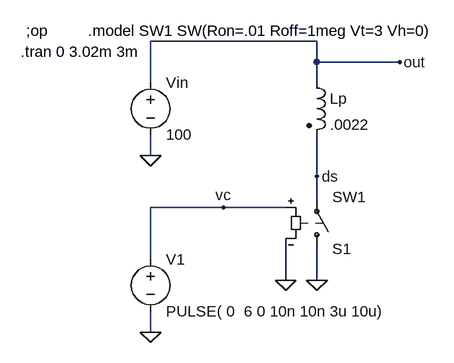
[diagram p0: schematic pulsed_inductor.asc]
pulsed_inductor.asc, the LTspice schematic file:
Version 4
SHEET 1 1728 680
WIRE 0 0 -256 0
WIRE 0 32 0 0
WIRE 128 32 0 32
WIRE -256 64 -256 0
WIRE 0 64 0 32
WIRE -256 176 -256 144
WIRE 0 208 0 144
WIRE 0 240 0 208
WIRE -144 256 -256 256
WIRE -48 256 -144 256
WIRE -256 336 -256 256
WIRE -48 368 -48 304
WIRE 0 368 0 320
WIRE -256 448 -256 416
FLAG 0 368 0
FLAG -48 368 0
FLAG -256 448 0
FLAG -256 176 0
FLAG -144 256 vc
FLAG 0 208 ds
FLAG 128 32 out
SYMBOL sw 0 336 M180
SYMATTR InstName S1
SYMATTR Value SW1
SYMBOL voltage -256 320 R0
WINDOW 123 0 0 Left 0
WINDOW 39 0 0 Left 0
SYMATTR InstName V1
SYMATTR Value PULSE( 0  6 0 10n 10n 3u 10u)
SYMBOL voltage -256 48 R0
WINDOW 123 0 0 Left 0
WINDOW 39 0 0 Left 0
SYMATTR InstName Vin
SYMATTR Value 100
SYMBOL ind2 -16 48 R0
SYMATTR InstName Lp
SYMATTR Value .0022
SYMATTR Type ind
TEXT -352 -16 Left 0 !.model SW1 SW(Ron=.01 Roff=1meg Vt=3 Vh=0)
TEXT -456 16 Left 0 !.tran 0 3.02m 3m
TEXT -448 -16 Left 0 !;op

The netlist it stands for:
* pulsed_inductor.asc
S1 0 ds vc 0 SW1
V1 vc 0 PULSE( 0  6 0 10n 10n 3u 10u)
Vin out 0 100
Lp out ds .0022
.model SW1 SW(Ron=.01 Roff=1meg Vt=3 Vh=0)
.tran 0 3.02m 3m
;op
.backanno
.end